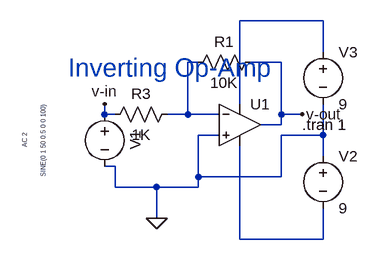
[diagram p0: schematic 1.invertingAmplifier.asc]
1.invertingAmplifier.asc, the LTspice schematic file:
Version 4.1
SHEET 1 880 680
WIRE 224 0 96 0
WIRE 224 48 224 0
WIRE 32 64 16 64
WIRE 160 64 112 64
WIRE 96 128 96 0
WIRE -112 144 -112 128
WIRE -96 144 -112 144
WIRE 16 144 16 64
WIRE 16 144 -16 144
WIRE 64 144 16 144
WIRE 160 144 160 64
WIRE 192 144 160 144
WIRE 160 160 160 144
WIRE 160 160 128 160
WIRE 64 176 32 176
WIRE 224 176 224 128
WIRE 224 176 160 176
WIRE 224 208 224 176
WIRE -96 224 -112 224
WIRE 32 240 32 176
WIRE 160 240 160 176
WIRE 160 240 32 240
WIRE -96 256 -96 224
WIRE -32 256 -96 256
WIRE 32 256 32 240
WIRE 32 256 -32 256
WIRE -32 304 -32 256
WIRE 96 336 96 192
WIRE 224 336 224 288
WIRE 224 336 96 336
FLAG -32 304 0
FLAG 192 144 v-out
FLAG -112 128 v-in
SYMBOL OpAmps\\UniversalOpAmp2 96 160 R0
SYMATTR InstName U1
SYMBOL voltage -112 128 R0
WINDOW 0 32 56 VTop 2
WINDOW 3 -88 56 VBottom 0
WINDOW 123 -116 56 VBottom 0
WINDOW 39 0 0 Left 0
SYMATTR InstName V1
SYMATTR Value SINE(0 1 50 0.5 0 0 100)
SYMATTR Value2 AC 2
SYMBOL res 128 48 R90
WINDOW 0 0 56 VBottom 2
WINDOW 3 32 56 VTop 2
SYMATTR InstName R1
SYMATTR Value 10K
SYMATTR SpiceLine tol=1 pwr=0.1
SYMBOL res 0 128 R90
WINDOW 0 0 56 VBottom 2
WINDOW 3 32 56 VTop 2
SYMATTR InstName R3
SYMATTR Value 1K
SYMATTR SpiceLine tol=1 pwr=0.1
SYMBOL voltage 224 192 R0
WINDOW 123 0 0 Left 0
WINDOW 39 0 0 Left 0
SYMATTR InstName V2
SYMATTR Value 9
SYMBOL voltage 224 32 R0
WINDOW 123 0 0 Left 0
WINDOW 39 0 0 Left 0
SYMATTR InstName V3
SYMATTR Value 9
TEXT 192 160 Left 2 !.tran 1
TEXT -168 72 Left 4 ;Inverting Op-Amp

The netlist it stands for:
* 1.invertingAmplifier.asc
X§U1 0 N002 N001 N003 v-out level2 Avol=1Meg GBW=10Meg Slew=10Meg Ilimit=25m Rail=0 Vos=0 En=0 Enk=0 In=0 Ink=0 Rin=500Meg  ; pins In+ In- V+ V- OUT
V1 v-in 0 SINE(0 1 50 0.5 0 0 100) AC 2
R1 v-out N002 10K tol=1 pwr=0.1
R3 N002 v-in 1K tol=1 pwr=0.1
V2 0 N003 9
V3 N001 0 9
.tran 1
* Inverting Op-Amp
.lib UniversalOpAmp2.lib
.backanno
.end